# EAGLE design Adafruit EZ-Link Breakout (EAGLE 6.3)
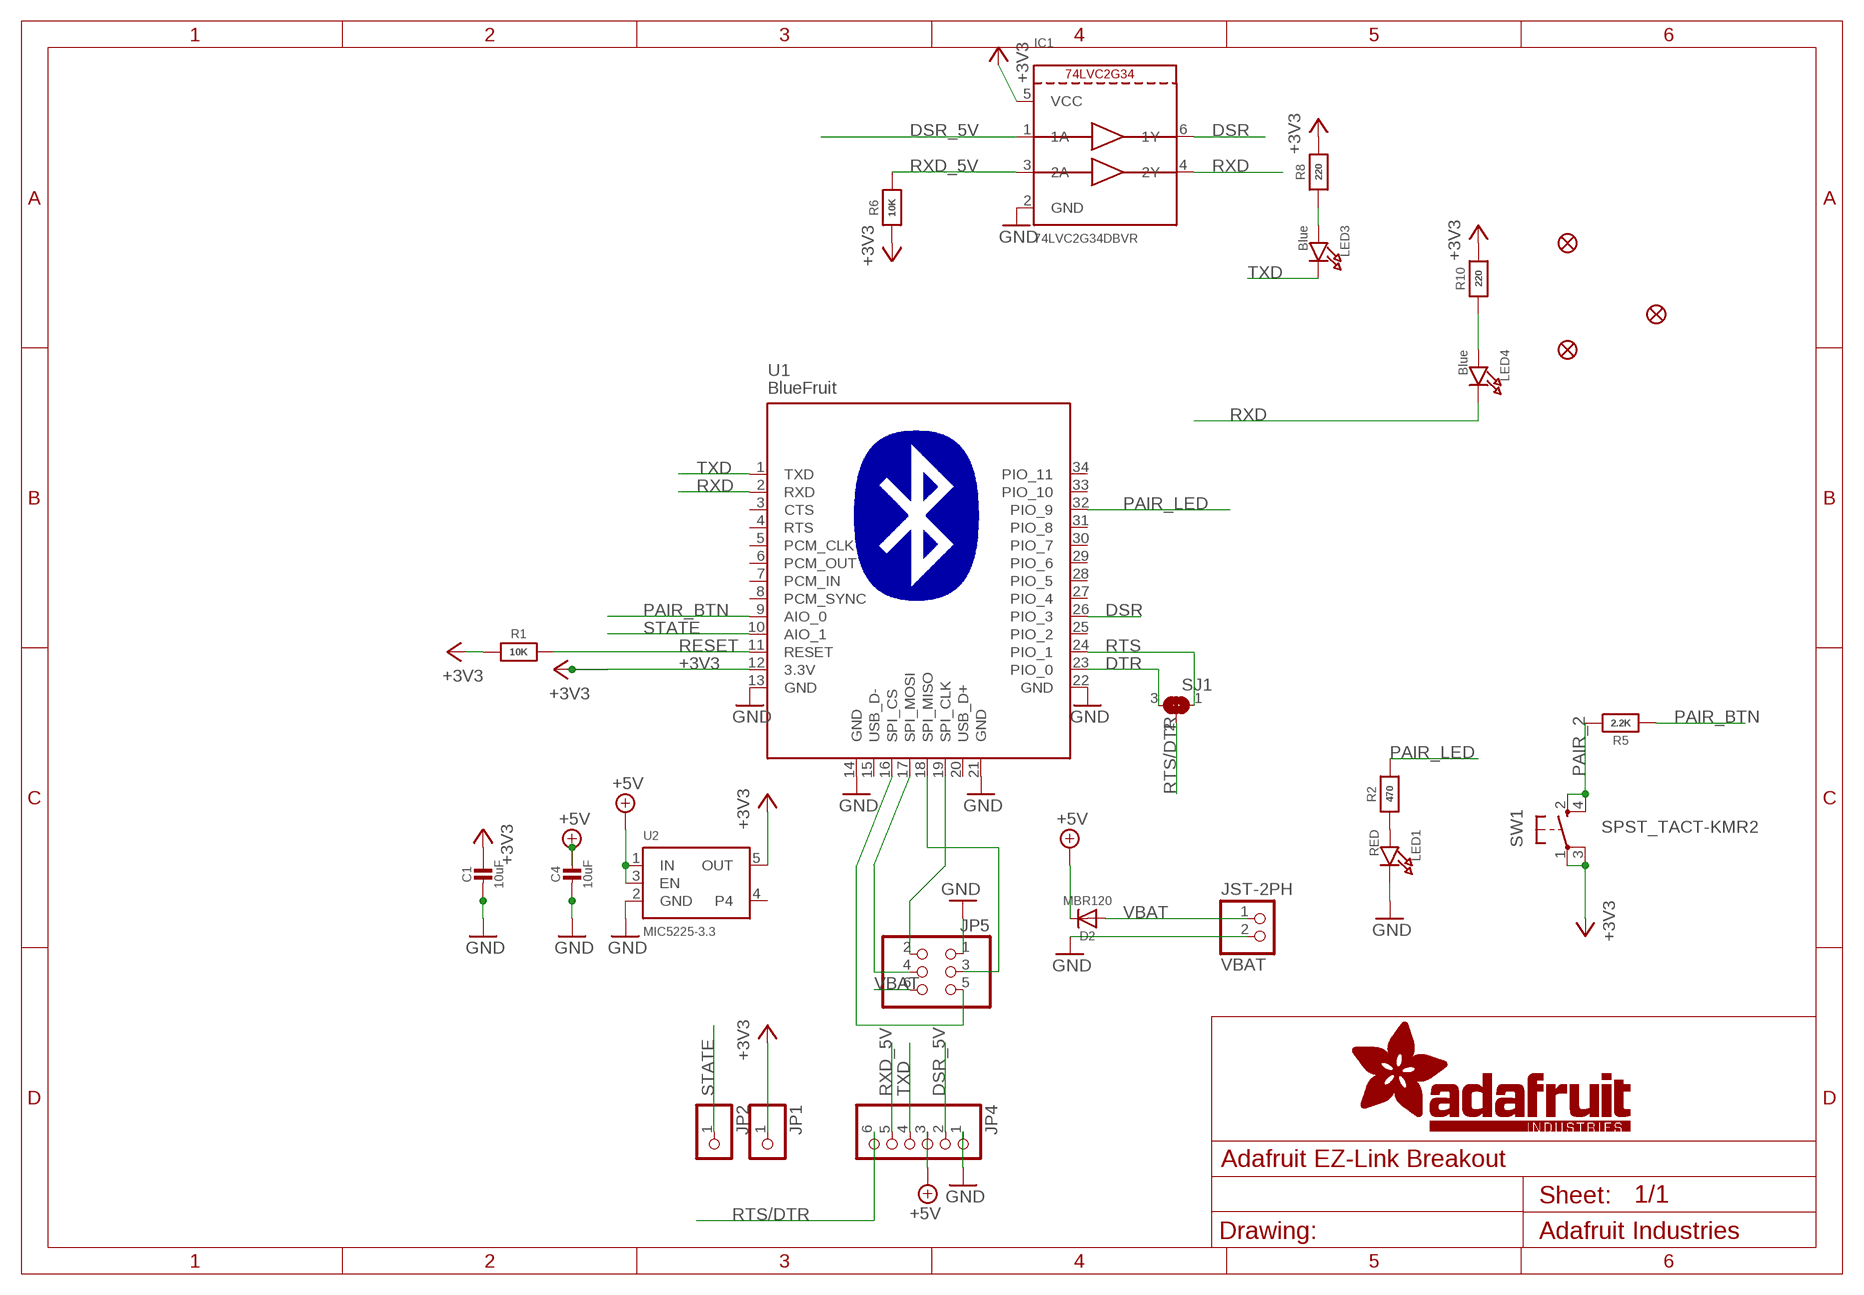
[diagram p0: schematic, sheet 1]

## Parts
C1  10uF  CAP_CERAMIC0805-NOOUTLINE  [0805-NO]
C4  10uF  CAP_CERAMIC0805-NOOUTLINE  [0805-NO]
D2  MBR120  DIODESOD-123  [SOD-123]
FID1  FIDUCIAL""  [FIDUCIAL_1MM]
FID2  FIDUCIAL""  [FIDUCIAL_1MM]
FID3  FIDUCIAL""  [FIDUCIAL_1MM]
IC1  74LVC2G34DBVR  [SOT23-6]
JP1  PINHD-1X1CB  [1X01-CLEANBIG]
JP2  PINHD-1X1CB  [1X01-CLEANBIG]
JP4  PINHD-1X6B  [1X06-BIG]
JP5  HEADER-2X3  [2X03_ROUND_70MIL]
LED1  RED  LED0805_NOOUTLINE  [CHIPLED_0805_NOOUTLINE]
LED3  Blue  LED0805_NOOUTLINE  [CHIPLED_0805_NOOUTLINE]
LED4  Blue  LED0805_NOOUTLINE  [CHIPLED_0805_NOOUTLINE]
R1  10K  RESISTOR0805_NOOUTLINE  [0805-NO]
R2  470  RESISTOR0805_NOOUTLINE  [0805-NO]
R5  2.2K  RESISTOR0805_NOOUTLINE  [0805-NO]
R6  10K  RESISTOR_0805MP  [_0805MP]
R8  220  RESISTOR0805_NOOUTLINE  [0805-NO]
R10  220  RESISTOR0805_NOOUTLINE  [0805-NO]
SJ1  SOLDERJUMPER_2WAY  [SOLDERJUMPER_2WAY_OPEN_NOPASTE]
SW1  SPST_TACT-KMR2  [KMR2]
U1  BlueFruit  BLUETOOTH_MODULE  [BLUETOOTH_MODULE]
U2  MIC5225-3.3  VREG_SOT23-5  [SOT23-5]
VBAT  JST-2PH  JST_2PIN-SMT-RA  [JST-PH-2-SMT-RA]

## Nets
+3V3: C1.1 IC1.5(VCC) JP1.1 R1.1 R6.1 R8.2 R10.2 SW1.1(P) SW1.3(P1) U1.12(3.3V) U2.5(OUT)
+5V: C4.1 D2.C JP4.3 U2.1(IN) U2.3(EN)
DSR: IC1.6(1Y) U1.26(PIO_3)
DSR_5V: IC1.1(1A) JP4.2
DTR: SJ1.3 U1.23(PIO_0)
GND: C1.2 C4.2 IC1.2(GND) JP4.1 JP5.1 LED1.C U1.13(GND) U1.14(GND) U1.21(GND) U1.22(GND) U2.2(GND) VBAT.2
N$2: LED1.A R2.1
N$6: LED3.A R8.1
N$10: LED4.A R10.1
PAIR_2: R5.2 SW1.2(S) SW1.4(S1)
PAIR_BTN: R5.1 U1.9(AIO_0)
PAIR_LED: R2.2 U1.32(PIO_9)
RESET: R1.2 U1.11(RESET)
RTS: SJ1.1 U1.24(PIO_1)
RTS/DTR: JP4.6 SJ1.2
RXD: IC1.4(2Y) LED4.C U1.2(RXD)
RXD_5V: IC1.3(2A) JP4.5 R6.2
SPI_CLK: JP5.2 U1.19(SPI_CLK)
SPI_CS: JP5.5 U1.16(SPI_CS)
SPI_MISO: JP5.3 U1.18(SPI_MISO)
SPI_MOSI: JP5.4 U1.17(SPI_MOSI)
STATE: JP2.1 U1.10(AIO_1)
TXD: JP4.4 LED3.C U1.1(TXD)
VBAT: D2.A JP5.6 VBAT.1
Unconnected: U1.3(CTS) U1.4(RTS) U1.5(PCM_CLK) U1.6(PCM_OUT) U1.7(PCM_IN) U1.8(PCM_SYNC) U1.15(USB_D-) U1.20(USB_D+) U1.25(PIO_2) U1.27(PIO_4) U1.28(PIO_5) U1.29(PIO_6) U1.30(PIO_7) U1.31(PIO_8) U1.33(PIO_10) U1.34(PIO_11) U2.4

## Library data of the parts
C1 C4 = microbuilder:CAP_CERAMIC: Ceramic Capacitors For new designs, use the packages preceded by an '_' character since they are more reliable: The following footprints should be used on most boards: _0402 - Standard footprint for regular board layouts _0603 - Standard footprint for regular board layouts _0805 - Standard footprint for regular board layouts _1206 - Standard footprint for regular board layouts For extremely tight-pitch boards where space is at a premium, the following 'micro-pitch' footprints can be used (smaller pads, no silkscreen outline, etc.): _0402MP - Micro-pitch footprint for very dense/compact boards _0603MP - Micro-pitch footprint for very dense/compact boards _0805MP - Micro-pitch footprint for very dense/compact boards _1206MP - Micro-pitch footprint for very dense/compact boards
D2 = microbuilder:DIODE: Diode SMA Model Volts Amps Type Vf Vr Digikey # Notes SSA34-E3 40V 3A Schottky 480mV @ 3A 200uA @ 40V SSA34-E3/61TGITR-ND CDBA120-G 20V 1A Schottky 500mV @ 1A 500uA @ 20V 641-1014-6-ND REEL MBRA210 10V 2A Schottky 350mV @ 2A 700uA @ 10V MBRA210LT3 SOD-123 Model Volts Amps Type Vf Vr Order # Notes BAT54T1G 30V 200mA Schottky 800mV @ 200mA 2uA @ 25V BAT54T1GOSTR-ND B0530W 30V 500mA Schottky 430mV @ 500mA 130uA @ 30V B0530W-FDICT-ND REEL MBR120 20V 1A Schottky 340mV @ 1A MBR120VLSFT1GOSCT-ND SOD-323 Model Volts Amps Type Vf Vr Order # Notes PMEG2005EJ 20V 500mA Schottky 355mV @ 500mA 568-4110-1-ND ZLLS410 10V 570mA Schottky 380mV @ 570mA ZLLS410CT-ND 1N4148WS 75V 150mA Silicon/Simple 1V 1N4148WSFSCT-ND REEL SOD-523 Model Volts Amps Type Vf Vr Order # Notes BAT54XV2 30V 200mA Schottky 0.8V @ 100mA BAT54XV2CT-ND TB751S 30V 30mA Schottky RB751S-40TE61CT-ND SOT23-R/W (R = Solder Paste/Reflow Ovens, W = Hand-Soldering) Model Volts Amps Type Vf Vr Order # Notes BAT54FILM 40V 300mA Schottky 497-7162-1-ND
FID1-FID3 = microbuilder:FIDUCIAL: Fiducial Alignment Points Various fiducial points for machine vision alignment.; BOM: EXCLUDE
IC1 = microbuilder:74LVC2G34
JP1 JP2 = adafruit:PINHD-1X1: Pin header 1x1 for 0.1" spacing With round pins
JP4 = adafruit:PINHD-1X6: PIN HEADER
JP5 = microbuilder:HEADER-2X3: PIN HEADER
LED1 LED3 LED4 = microbuilder:LED: LED 0603 - 0603 Surface Mount Package 2mA: Green LED - Low Power (3.9mcd, 2ma, 1.7Vf) - Digikey: 475-2709-2-ND Orange LED - Low Power (9.8mcd, 2ma, 1.8Vf) - Digikey: 475-1194-2-ND Red LED - Low Power (5mcd, 2ma, 1.8Vf) - Digikey: 475-1195-2-ND Yellow LED - Low Power (7mcd, 2ma, 1.8Vf) - Digikey: 475-1196-2-ND 5mA: Blue LED - Low Power (17mcd, 5ma, 2.9Vf) - Digikey: LNJ937W8CRACT-ND 0805 - 0805 Surface Mount Package 2mA: Red LED (8.8mcd, 2mA, 1.8Vf, Clear) - Low Power [Digikey: 475-2510-1-ND] Green LED (5mcd, 2mA, 1.8Vf, Clear) - Low Power [Digikey: 475-2730-1-ND] Yellow LED (11.3mcd, 2mA, 1.8Vf, Clear) - Low Power [Digikey: 475-2555-1-ND] 20mA: Red LED (104mcd, 20mA, Diffused) - LS R976 [Digikey: 475-1278-6-ND] Red LED (12mcd, 20mA, 2.0Vf, Clear) - APT2012EC [Digikey: 754-1128-1-ND] Green LED (15mcd, 20mA, 2.2Vf, Clear) - APT2012GC [Digikey: 754-1131-1-ND] Orange LED (160mcd, 20mA, 2.1Vf, Clear) - APT2012SECK [Digikey: 754-1130-1-ND] 1206 - 1206 Surface Mount Package Green LED (26mcd, 20mA, Diffused) - LG N971 [Digikey: 475-1407-6-ND] Red LED (15mcd, 20mA, Diffused) - LH N974 [Digikey: 475-1416-6-ND] Cree - Cree High-Power Surface Mount LEDs XPEBWT-L1-0000-00D50 - White 111lm 350mA 2.9Vf 6200K 110° XTEAWT-00-0000-00000LEE3 - White 114lm 350mA 2.85Vf 5000K 115° Everlight - Everlight 45-21 Series Surface Mount LEDs 45-21/QK2C-B2832AC2CB2/2T - Warm White 2000mcd 20mA 3.25Vf 3050K 120° 45-21/LK2C-B38452C4CB2/2T - Nuetral White 2000mcd 20mA 3.25Vf 4150K 120° 45-21/LK2C-B50634C6CB2/2T - Cold White 2200mcd 20mA 3.25Vf 5650K 120° PLCC2 Reverse Mount LS T77K-J1L2-1-0-2-R18-Z - Red 11.25mcd 2mA 1.8Vf 630nm 120° LO T77K-L1M2-24-Z - Orange 19.6mcd 2mA 1.8Vf 606nm 120° LY T77K-K2M1-26-Z - Yellow 15.7mcd 2mA 1.8Vf 587nm 120°
R1 R2 R5 R6 R8 R10 = microbuilder:RESISTOR: Resistors For new designs, use the packages preceded by an '_' character since they are more reliable: The following footprints should be used on most boards: _0402 - Standard footprint for regular board layouts _0603 - Standard footprint for regular board layouts _0805 - Standard footprint for regular board layouts _1206 - Standard footprint for regular board layouts For extremely tight-pitch boards where space is at a premium, the following 'micro-pitch' footprints can be used (smaller pads, no silkscreen outline, etc.): _0402MP - Micro-pitch footprint for very dense/compact boards _0603MP - Micro-pitch footprint for very dense/compact boards _0805MP - Micro-pitch footprint for very dense/compact boards _1206MP - Micro-pitch footprint for very dense/compact boards
SJ1 = microbuilder:SOLDERJUMPER_2WAY: 2-Way Solder Jumper
SW1 = adafruit:SPST_TACT: SMT 6mm switch, EVQQ2 series http://www.ladyada.net/library/eagle
U1 = microbuilder:BLUETOOTH_MODULE: BLUETOOTH MODULE
U2 = microbuilder:VREG_SOT23-5: SOT23-5 Fixed Voltage Regulators Part Current Out V Out V In V Dropout θJA (°C/W) TJ (°C) Digikey Part No. ADP121 150mA 3.3V 3.4-5.5V 0.09V @ 150mA -- -- ADP121-AUJZ33R7CT-ND ADP121 150mA 3.0V 3.1-5.5V 0.09V @ 150mA -- -- ADP121-AUJZ30R7CT-ND ADP122 300mA 3.3V 3.4-5.5V 0.085V @ 300mA -- -- ADP122AUJZ-3.3-R7CT-ND ADP1712 300mA 3.3V 3.5-5.5V 0.17V @ 300mA -- -- ADP1712AUJZ-3.3-R7TR-ND AP7311 (Low Cost) 150mA 3.3V 3.5-6V 0.15V @ 150mA -- -- AP7311-33WG-7DICT-ND LD39015M18R 150mA 1.8V 1.9V-5.5V 0.08V @ 100mA -- -- 497-6977-1-ND LP2985A-33DBVR 150mA 3.3V 3.3-16V 0.28V @ 150mA 206 150 296-18479-1-ND MCP1824T-3302E/OT 300mA 3.3V 3.5V-6V 0.2V @ 300mA -- -- MCP1824T-3302E/OTCT-ND MIC5205-2.5YM5 TR 150mA 2.5V 2.7-16V 0.165V @ 150mA -- -- 576-1257-2-ND MIC5205-3.0YM5 TR 150mA 3.0V 3.2V-16V 0.165V @ 150mA -- -- 576-1258-2-ND MIC5205-3.3YM5 TR 150mA 3.3V 3.5V-16V 0.165V @ 150mA -- -- 576-1259-2-ND TPS780330220 150mA 3.3V+2.2V 3.6-5.5V 250mV Max -- -- 296-23332-1-ND TDA3663/N1,135 100mA 3.3V 3.5-45V 0.18V @ 50mA -- -- 568-5343-1-ND Max operating temp can be calculated using θJA, TJ (max junction temperature), and power in watts. Set the "Maximum Ambient Temperature" until it reaches TJ ("Max Junction Temperature"), which is the absolute limit for safe use of the regulator: Heat Sink Temperature Calculator <http://www.daycounter.com/Calculators/Heat-Sink-Temperature-Calculator.phtml> For example, With 12V source into a 3.3V LP2985 and a 30mA load, we are dissipating (12V-3.3V) * 0.03A = 0.261W. With a θJA of 206 °C/W, a TJ of 150°C, and 261mW we can safely use the chip without a heat sink up to 75°C (=147.1°C Junction Temperature).
VBAT = adafruit:JST_2PIN: JST 2-Pin Connectors of various flavors SMT-RA (S2B-PH-SM4) 4UConnector #17311 SMT (B2B-PH-SM4) THM-RA (S2B-PH) THM (B2B-PH)

## Board
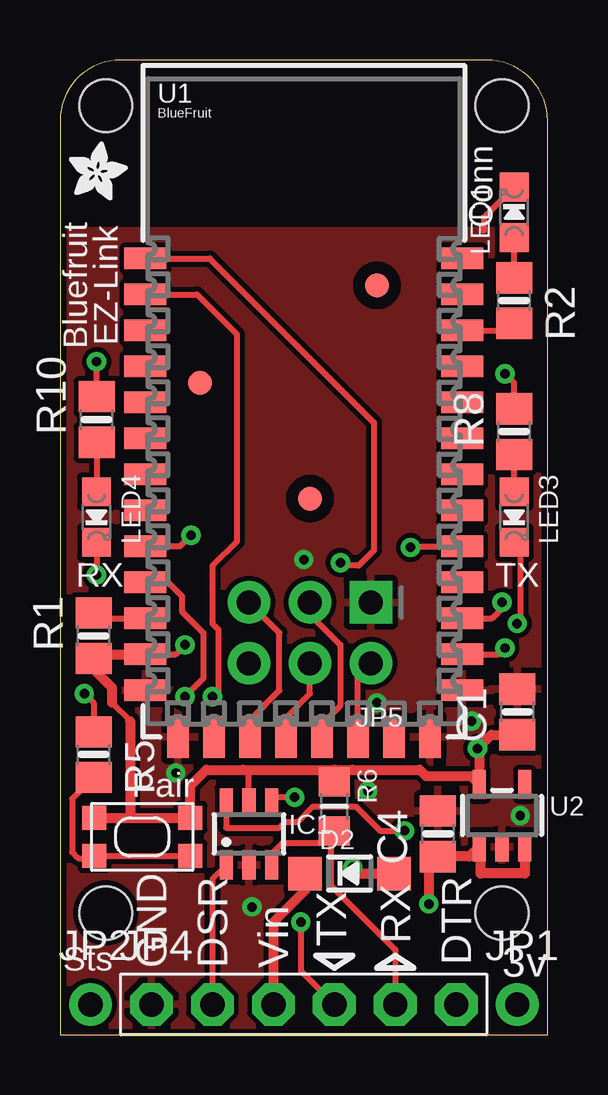
[diagram p1: board, top side]
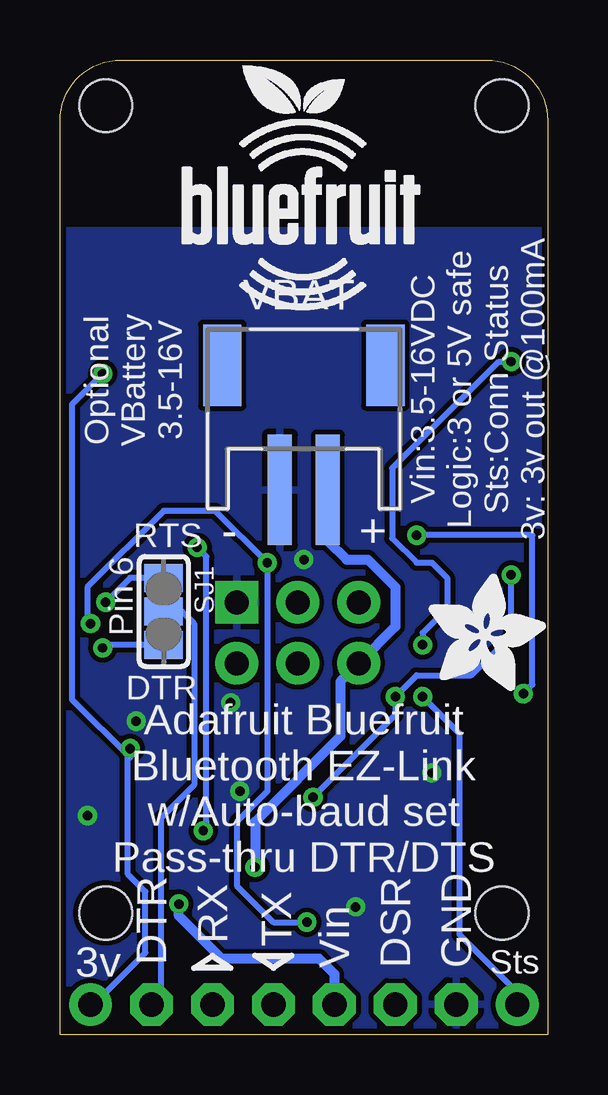
[diagram p2: board, bottom side, seen from below]

Size 20.32 x 40.64 mm. Coordinates in mm from the lower left corner, seen from the top.
Outline: 0,0 20.32,0 20.32,38.1 arc90 17.78,40.64 2.54,40.64 arc90 0,38.1 0,0
Copper layers (1*16): Top 0.035mm / dielectric 1.5mm / Bottom 0.035mm
Design rules "adafruit *": minimum track width 8mil, minimum drill 15.5mil, track to track 8mil, track to pad 8mil, pad to pad 8mil, via to via 8mil, smd to smd 8mil, copper to edge 10mil, drill to drill 8mil, minimum pad ring 10mil, minimum via ring 8mil, stop-mask expansion 4mil, vias tented up to drill 20mil, thermal gap 10mil
Holes 2.2 mm at 18.41,5.08 1.91,5.08 1.91,38.73 18.41,38.73

### Footprints (pad centres in the part's own frame; a part is rotated, then mirrored left to right if it is on the bottom)
0805-NO = smd 1.3 x 1.5: 1 -0.95,0; 2 0.95,0
SOD-123 = smd 1.4 x 1.4: A 1.85,0; C -1.85,0
FIDUCIAL_1MM = smd 1 x 1: 1 0,0
SOT23-6 = smd 0.55 x 1.2: 1 -0.95,-1.3; 2 0,-1.3; 3 0.95,-1.3; 4 0.95,1.3; 5 0,1.3; 6 -0.95,1.3
1X01-CLEANBIG = drill 1.016 pad 1.778: 1 0,0
1X06-BIG = drill 1.016 pad 1.778 octagon: 1 -6.35,0; 2 -3.81,0; 3 -1.27,0; 4 1.27,0; 5 3.81,0; 6 6.35,0
2X03_ROUND_70MIL = drill 1 pad 1.778 square: 1 -2.54,-1.27 | drill 1 pad 1.778: 2 -2.54,1.27; 3 0,-1.27; 4 0,1.27; 5 2.54,-1.27; 6 2.54,1.27
CHIPLED_0805_NOOUTLINE = smd 1.2 x 1.2: A 0,-1.05; C 0,1.05
_0805MP = smd 1.2 x 1.3: 1 -1.016,0; 2 1.016,0
SOLDERJUMPER_2WAY_OPEN_NOPASTE = smd 1.168 x 1.6: 1 -1.397,0; 2 0,0; 3 1.397,0
KMR2 = smd 1 x 1: 1 2,0.8; 2 2,-0.8; 3 -2,0.8; 4 -2,-0.8
BLUETOOTH_MODULE = smd 1.75 x 0.9: 1 -6.6,5.95; 2 -6.6,4.45; 3 -6.6,2.95; 4 -6.6,1.45; 5 -6.6,-0.05; 6 -6.6,-1.55; 7 -6.6,-3.05; 8 -6.6,-4.55; 9 -6.6,-6.05; 10 -6.6,-7.55; 11 -6.6,-9.05; 12 -6.6,-10.55; 13 -6.6,-12.05; 22 6.6,-12.05; 23 6.6,-10.55; 24 6.6,-9.05; 25 6.6,-7.55; 26 6.6,-6.05; 27 6.6,-4.55; 28 6.6,-3.05; 29 6.6,-1.55; 30 6.6,-0.05; 31 6.6,1.45; 32 6.6,2.95; 33 6.6,4.45; 34 6.6,5.95 | smd 0.9 x 1.75: 14 -5.25,-14; 15 -3.75,-14; 16 -2.25,-14; 17 -0.75,-14; 18 0.75,-14; 19 2.25,-14; 20 3.75,-14; 21 5.25,-14
SOT23-5 = smd 0.55 x 1.2: 1 -0.95,-1.3; 2 0,-1.3; 3 0.95,-1.3; 4 0.95,1.3; 5 -0.95,1.3
JST-PH-2-SMT-RA = smd 1 x 4.6: 1 1,-3.7; 2 -1,-3.7 | smd 1.6 x 3.4: NC1 -3.4,1.5; NC2 3.4,1.5

### Placement (x,y rotation side)
C1  19.05,13.46 90 top
C4  15.75,8.38 90 top
D2  12.06,6.73 0 top
FID1  10.41,22.35 0 top
FID2  5.84,27.18 0 top
FID3  13.21,31.24 0 top
IC1  7.87,8.38 0 top
JP1  19.05,1.27 0 top
JP2  1.27,1.27 0 top
JP4  10.16,1.27 0 top
JP5  10.41,16.76 180 top
LED1  18.92,34.29 0 top
LED3  18.92,21.59 180 top
LED4  1.52,21.59 180 top
R1  1.4,16.64 90 top
R2  18.92,30.61 270 top
R5  1.4,11.68 270 top
R6  11.43,9.53 270 top
R8  18.92,25.15 90 top
R10  1.52,25.65 90 top
SJ1  16,17.65 270 bottom
SW1  3.43,8.26 0 top
U1  10.16,26.42 0 top
U2  18.41,9.14 0 top
U$2  [ADAFRUIT_5MM]  4.95,14.35 0 bottom
U$3  [ADAFRUIT_2.5MM]  0.38,34.8 0 top
U$4  [BLUEFRUITLOGO_100MM]  15.24,30.23 0 bottom
VBAT  10.16,26.42 0 bottom

### Tracks (layer width: path | path; a pad name or v marks a point on that pad's centre or on a via)
+3V3  (via drill 0.39)
  Top 0.254: R10.2 v1.52,28.07 | 1.4,15.37 R1.1 1.58,15.87 | 2.16,13.84 2.92,13.08 | R8.2 18.92,27.18 v18.54,27.56 | 17.5,11.84 v17.4,11.94 | 17.5,10.47 U2.5 | 12,11.05 12.19,11.05 | U1.12 4.82,15.87 v5.21,16.26 | IC1.5 7.87,11.05 7.62,11.05 | R6.1 11.43,11.05
  Top 0.406: v17.4,11.94 17.97,12.51 C1.1 | SW1.3 2.92,9.05 | 2.92,9.05 SW1.1 5.43,10.38 6.1,11.05 7.62,11.05 11.43,11.05 12.19,11.05 14.99,11.05 15.24,10.79 17.11,10.79 U2.5 | 2.16,13.84 2.16,14.48 1.4,15.24 R1.1 | 2.92,13.08 2.92,9.05 | 1.58,15.87 U1.12 | 17.5,10.47 17.5,11.84
  Bottom 0.254: v5.21,16.26 5.21,16.76 4.19,17.78 4.19,19.05 4.83,19.68 5.46,19.68 6.48,20.7 6.48,23.62 2.03,28.07 v1.52,28.07 | v18.54,27.56 19.81,26.29 19.81,13.97 17.4,11.56 v17.4,11.94 17.5,11.94 17.5,6.7 16.76,5.97 16.76,3.43 18.92,1.27 JP1.1
+5V  (via drill 0.39)
  Top 0.254: 17.53,7.84 U2.1 | C4.1 15.37,7.05
  Top 0.406: U2.3 19.36,6.73 17.53,6.73 17.53,7.84 | 15.37,7.05 v15.37,5.46 | U2.1 17.05,7.43 C4.1 | D2.C 10.21,6.02 8.89,4.7 JP4.3
  Bottom 0.406: JP4.3 8.89,2.54 9.53,3.17 13.59,3.17 15.37,4.95 v15.37,5.46
DSR  (via drill 0.39)
  Top 0.254: v14.61,20.32 14.61,20.37 U1.26 | IC1.6 6.92,8.64 9.14,8.64 9.4,8.89 9.91,8.89 10.54,9.53 12.32,9.53 13.34,8.51 v14.35,8.51
  Bottom 0.254: v14.35,8.51 14.35,8.76 14.22,8.89 14.22,19.94 v14.61,20.32
DSR_5V
  Top 0.254: JP4.2 6.35,6.48 6.92,7.05 IC1.1
DTR  (via drill 0.39)
  Top 0.254: U1.23 18.28,15.87 v18.54,16.13
  Bottom 0.254: v18.54,16.13 18.41,16.26 SJ1.3 16,16.38 16,16.64 16,17.53
GND  (via drill 0.39)
  Top 0.254: 15.4,9.68 C4.2 | LED1.C 17.65,34.07 17.65,33.53
  other vias: 19.18,9.14 8,5.33 17.14,13.08 4.83,10.92 10.16,19.81 13.21,13.84 12.83,10.16
  pour Bottom: -1.14,33.53 -1.02,0 21.84,0 21.72,33.53
  pour Top: -1.14,33.53 -1.02,0 21.84,0 21.72,33.53
N$2
  Top 0.254: R2.1 LED1.A
N$6
  Top 0.254: LED3.A R8.1
N$10
  Top 0.254: R10.1 LED4.A
PAIR_2
  Top 0.254: R5.2 0.51,9.85 0.51,7.62 0.76,7.37 1.34,7.37 SW1.4 SW1.2
PAIR_BTN  (via drill 0.39)
  Top 0.254: v5.46,20.83 5,20.37 U1.9 | v1.02,14.22 1.4,13.84 R5.1
  Bottom 0.254: v1.02,14.22 0.64,14.61 0.64,20.83 v5.46,20.83
PAIR_LED
  Top 0.254: U1.32 18.63,29.37 R2.2
RESET
  Top 0.254: R1.2 1.62,17.37 U1.11
RTS  (via drill 0.39)
  Top 0.254: U1.24 18,17.37 18.54,17.91 v18.41,18.03
  Bottom 0.254: SJ1.1 17.4,19.05 v18.41,18.03
RTS/DTR
  Bottom 0.254: SJ1.2 15.24,17.65 14.73,17.14 14.73,10.41 16.13,9.02 16.13,1.65 JP4.6
RXD  (via drill 0.39)
  Top 0.254: U1.2 5.71,30.87 7.37,29.21 7.37,20.57 6.35,19.56 6.35,17.14 6.6,16.89 6.6,14.35 v6.35,14.1 | LED4.C v1.52,19.18 | v9.78,9.91 9.05,9.91 IC1.4
  Bottom 0.254: v1.52,19.18 1.52,16.64 3.17,14.99 5.46,14.99 v6.35,14.1 6.35,13.34 v9.78,9.91
RXD_5V
  Top 0.254: JP4.5 13.97,3.56 11.3,6.22 11.3,8.38 R6.2 10.92,8 9.27,8 8.82,7.55 IC1.3
SPI_CLK
  Top 0.254: U1.19 12.41,14.95 JP5.2
SPI_CS
  Top 0.254: JP5.5 9.14,16.76 9.14,14.35 7.91,13.12 U1.16
SPI_MISO
  Top 0.254: JP5.3 10.41,17.53 11.68,16.26 11.68,13.72 10.91,12.94 U1.18
SPI_MOSI
  Top 0.254: U1.17 9.41,13.22 10.41,14.22 JP5.4
STATE  (via drill 0.39)
  Top 0.254: U1.10 4.5,18.87 5.08,18.29 5.08,17.65 5.97,16.76 5.97,14.86 v5.21,14.1
  Bottom 0.254: v5.21,14.1 3.68,12.57 3.68,4.19 1.27,1.78 JP2.1
TXD  (via drill 0.39)
  Top 0.254: U1.1 6.24,32.37 13.08,25.53 13.08,20.19 12.45,19.56 11.68,19.56 v11.68,19.68 | LED3.C 19.18,20.54 19.18,17.27 v19.05,17.14 | v10.03,4.7 10.03,2.67 JP4.4
  Bottom 0.254: v19.05,17.14 19.18,17.27 19.18,18.67 16,21.84 13.84,21.84 v11.68,19.68 11.68,10.16 12.95,8.89 12.95,6.22 11.43,4.7 v10.03,4.7
VBAT  (via drill 0.39)
  Top 0.406: v12.19,6.99 12.45,6.73 D2.A
  Bottom 0.406: VBAT.1 9.16,20.59 8.38,19.81 7.49,19.81 6.35,18.67 6.35,17.02 JP5.6 8.64,14.73 8.64,12.45 12.19,8.89 v12.19,6.99

### Text on the board
tPlace: Conn | Bluefruit | EZ-Link | RX | TX | Pair | TX | RX | Sts | GND | DSR | Vin | DTR | 3v
bPlace: Vin:3.5-16VDC / Logic:3 or 5V safe / Sts:Conn Status / 3v: 3v out @100mA | Optional / VBattery / 3.5-16V | RTS | Pin 6 | DTR | Adafruit Bluefruit / Bluetooth EZ-Link / w/Auto-baud set / Pass-thru DTR/DTS | TX | RX | Sts | GND | DSR | Vin | DTR | 3v